# Altium schematic sheet stc89c52.SchDoc
size A4; SheetNumber: 1; SheetTotal: 1
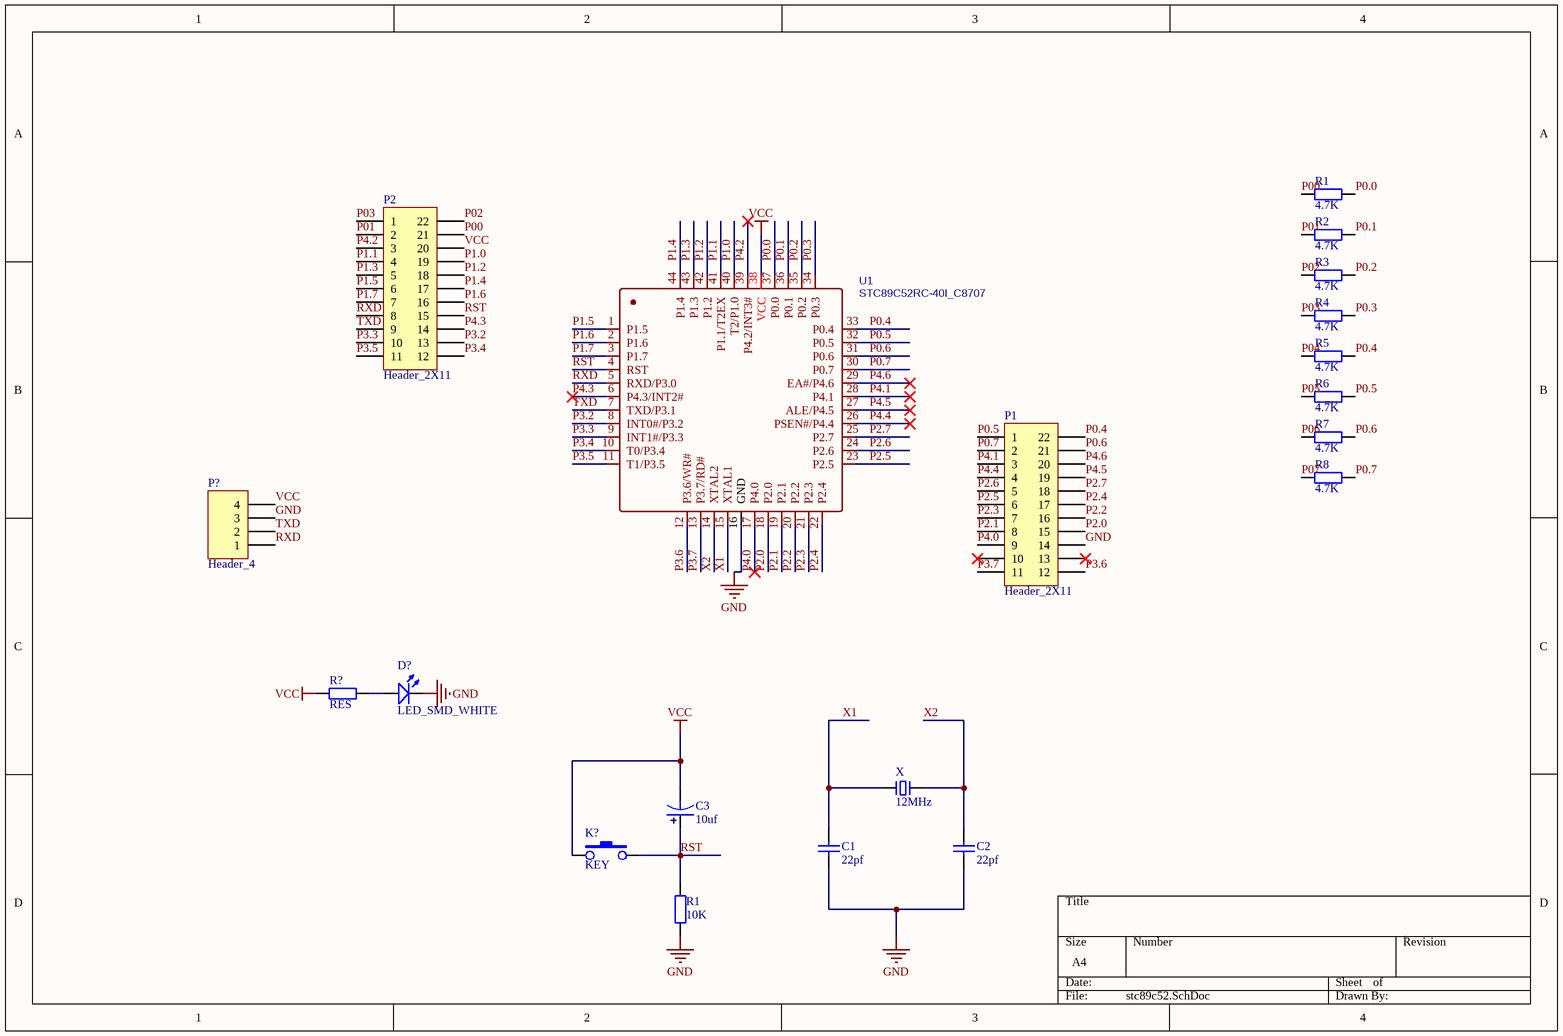
[diagram p0: stc89c52.SchDoc]

## Parts
(Parts that share a designator on the sheet are numbered #1, #2 ... from top to bottom, then left to right.)
C1  22pf  [Cap-0603]
C2  22pf  [Cap-0603]
C3  10uf  [CAP_TAN_3216_A]
D?  LED_SMD_WHITE  [LED_0603_W]
K?  KEY  [SW-SMD-3X6X2.5]
P1  Header_2X11  [Header 2.54_2X11]
P2  Header_2X11  [Header 2.54_2X11]
P?  Header_4  [Header H 2.54X4]
R1#1  4.7K  [R-0603]
R1#2  10K  [R-0603]
R2  4.7K  [R-0603]
R3  4.7K  [R-0603]
R4  4.7K  [R-0603]
R5  4.7K  [R-0603]
R6  4.7K  [R-0603]
R7  4.7K  [R-0603]
R8  4.7K  [R-0603]
R?  RES  [R-0603]
U1  STC89C52RC-40I_C8707  [STC89C52RC-40I-LQFP44]
X  12MHz  [OSC HC-49S]

## Nets
GND: C1.1 C2.1 D?.2(K) P1.14 P?.3 R1#2.1 U1.16(GND)
VCC: C3.2 K?.1 P2.20 P?.4 R?.1 U1.38(VCC)
P00: P2.21 R1#1.1
P0.0: R1#1.2 U1.37(P0.0)
P0.1: R2.2 U1.36(P0.1)
P0.2: R3.2 U1.35(P0.2)
P0.3: R4.2 U1.34(P0.3)
P0.4: P1.22 R5.2 U1.33(P0.4)
P0.5: P1.1 R6.2 U1.32(P0.5)
P0.6: P1.21 R7.2 U1.31(P0.6)
P0.7: P1.2 R8.2 U1.30(P0.7)
P01: P2.2 R2.1
P1.0: P2.19 U1.40(T2/P1.0)
P1.1: P2.4 U1.41(P1.1/T2EX)
P1.2: P2.18 U1.42(P1.2)
P1.3: P2.5 U1.43(P1.3)
P1.4: P2.17 U1.44(P1.4)
P1.5: P2.6 U1.1(P1.5)
P1.6: P2.16 U1.2(P1.6)
P1.7: P2.7 U1.3(P1.7)
P02: P2.22 R3.1
P2.0: P1.15 U1.18(P2.0)
P2.1: P1.8 U1.19(P2.1)
P2.2: P1.16 U1.20(P2.2)
P2.3: P1.7 U1.21(P2.3)
P2.4: P1.17 U1.22(P2.4)
P2.5: P1.6 U1.23(P2.5)
P2.6: P1.5 U1.24(P2.6)
P2.7: P1.18 U1.25(P2.7)
P03: P2.1 R4.1
P3.2: P2.13 U1.8(INT0#/P3.2)
P3.3: P2.10 U1.9(INT1#/P3.3)
P3.4: P2.12 U1.10(T0/P3.4)
P3.5: P2.11 U1.11(T1/P3.5)
P3.6: P1.12 U1.12(P3.6/WR#)
P3.7: P1.11 U1.13(P3.7/RD#)
P04: R5.1
P4.0: P1.9 U1.17(P4.0)
P4.1: P1.3 U1.28(P4.1)
P4.2: P2.3 U1.39(P4.2/INT3#)
P4.3: P2.14 U1.6(P4.3/INT2#)
P4.4: P1.4 U1.26(PSEN#/P4.4)
P4.5: P1.19 U1.27(ALE/P4.5)
P4.6: P1.20 U1.29(EA#/P4.6)
P05: R6.1
P06: R7.1
P07: R8.1
RST: C3.1 K?.3 P2.15 R1#2.2 U1.4(RST)
RXD: P2.8 P?.1 U1.5(RXD/P3.0)
TXD: P2.9 P?.2 U1.7(TXD/P3.1)
X1: C1.2 U1.15(XTAL1) X.1
X2: C2.2 U1.14(XTAL2) X.2
NetD?_1: D?.1(A) R?.2

Not connected (* = marked no-connect by the designer): P1 10* 13*

## Library data of the parts
C1 C2 = CAP: 贴片陶瓷电容
C3 = CAP-TAN: 钽电容
D? = LED_SMD_WHITE: 发光二极管; ComponentLink1Description: 供应商链接; ComponentLink1URL: http://www.szlcsc.com/product/details_2663.html; Package: 0603; Supplier: LC; SuppliersPartNumber: C2290
R1#1 R1#2 R2-R8 R? = RES: 贴片电阻
U1 = STC89C52RC-40I_C8707: BOM_Manufacturer: STC; BOM_Supplier: LCSC; BOM_Manufacturer Part: STC89C52RC-40I; BOM_Supplier Part: C8707; BOM_JLCPCB Part Class: Extended Part; spicePre: U; spiceSymbolName: STC89C52RC-40I_C8707
X = XTAL-2P: 2脚无源脚晶振